# EAGLE design Aladdin Lamp (EAGLE 9.6.2)

## Sheet 1 of 2
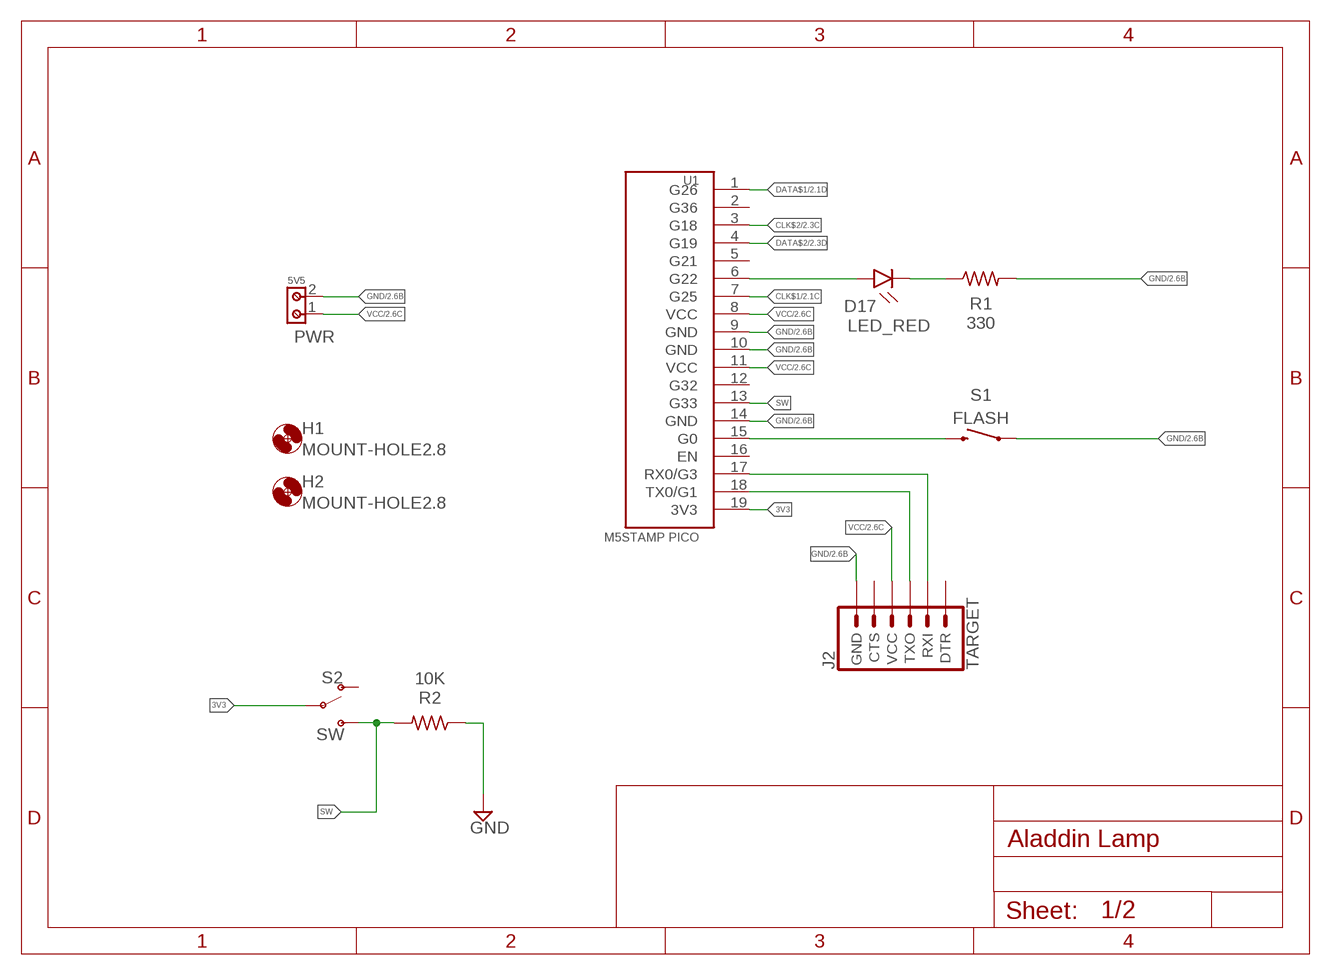
[diagram p0: schematic, sheet 1]

### Parts
D17  LED_RED  CHIP-FLAT-R_0805  [LEDC2012X110N_FLAT-R]
H1  MOUNT-HOLE2.8  [2,8]
H2  MOUNT-HOLE2.8  [2,8]
J2  TARGET  6_PIN_SERIAL_TARGETSILK  [6_PIN_SERIAL_TARGET_SIDE_W_SILK]
PWR  5V5  691213510002  [691213510002]
R1  330  R-US_CHIP-0805(2012-METRIC)  [RESC2012X65]
R2  10K  R-US_CHIP-0805(2012-METRIC)  [RESC2012X65]
S1  FLASH  MOMENTARY-SWITCH-SPST-SMD-5.2MM  [TACTILE_SWITCH_SMD_5.2MM]
S2  SW  SWITCH-SPDT-SMD-RIGHT-ANGLE  [SWITCH_SPST_SMD_A]
U1  M5STAMP PICO  M5STAMP-PICO  [M5STAMP-PICO]

### Nets
3V3: S2.2(P) U1.19(3V3)
CLK$1: U1.7(G25) ; also sheet 2
CLK$2: U1.3(G18) ; also sheet 2
DATA$1: U1.1(G26) ; also sheet 2
DATA$2: U1.4(G19) ; also sheet 2
G0: S1.3 U1.15(G0)
GND: J2.P$6(GND) PWR.2 R1.2 R2.1 S1.1 U1.9(GND) U1.10(GND) U1.14(GND) ; also sheet 2
RX: J2.P$3(RXI) U1.17(RX0/G3)
SATUS_LED$1: D17.A U1.6(G22)
SATUS_LED$2: D17.C R1.1
SW: R2.2 S2.3(S) U1.13(G33)
TX: J2.P$2(TXO) U1.18(TX0/G1)
VCC: J2.P$4(VCC) PWR.1 U1.8(VCC) U1.11(VCC) ; also sheet 2
Unconnected: J2.P$1(DTR) J2.P$5(CTS) S2.1(O) U1.2(G36) U1.5(G21) U1.12(G32) U1.16(EN)

## Sheet 2 of 2
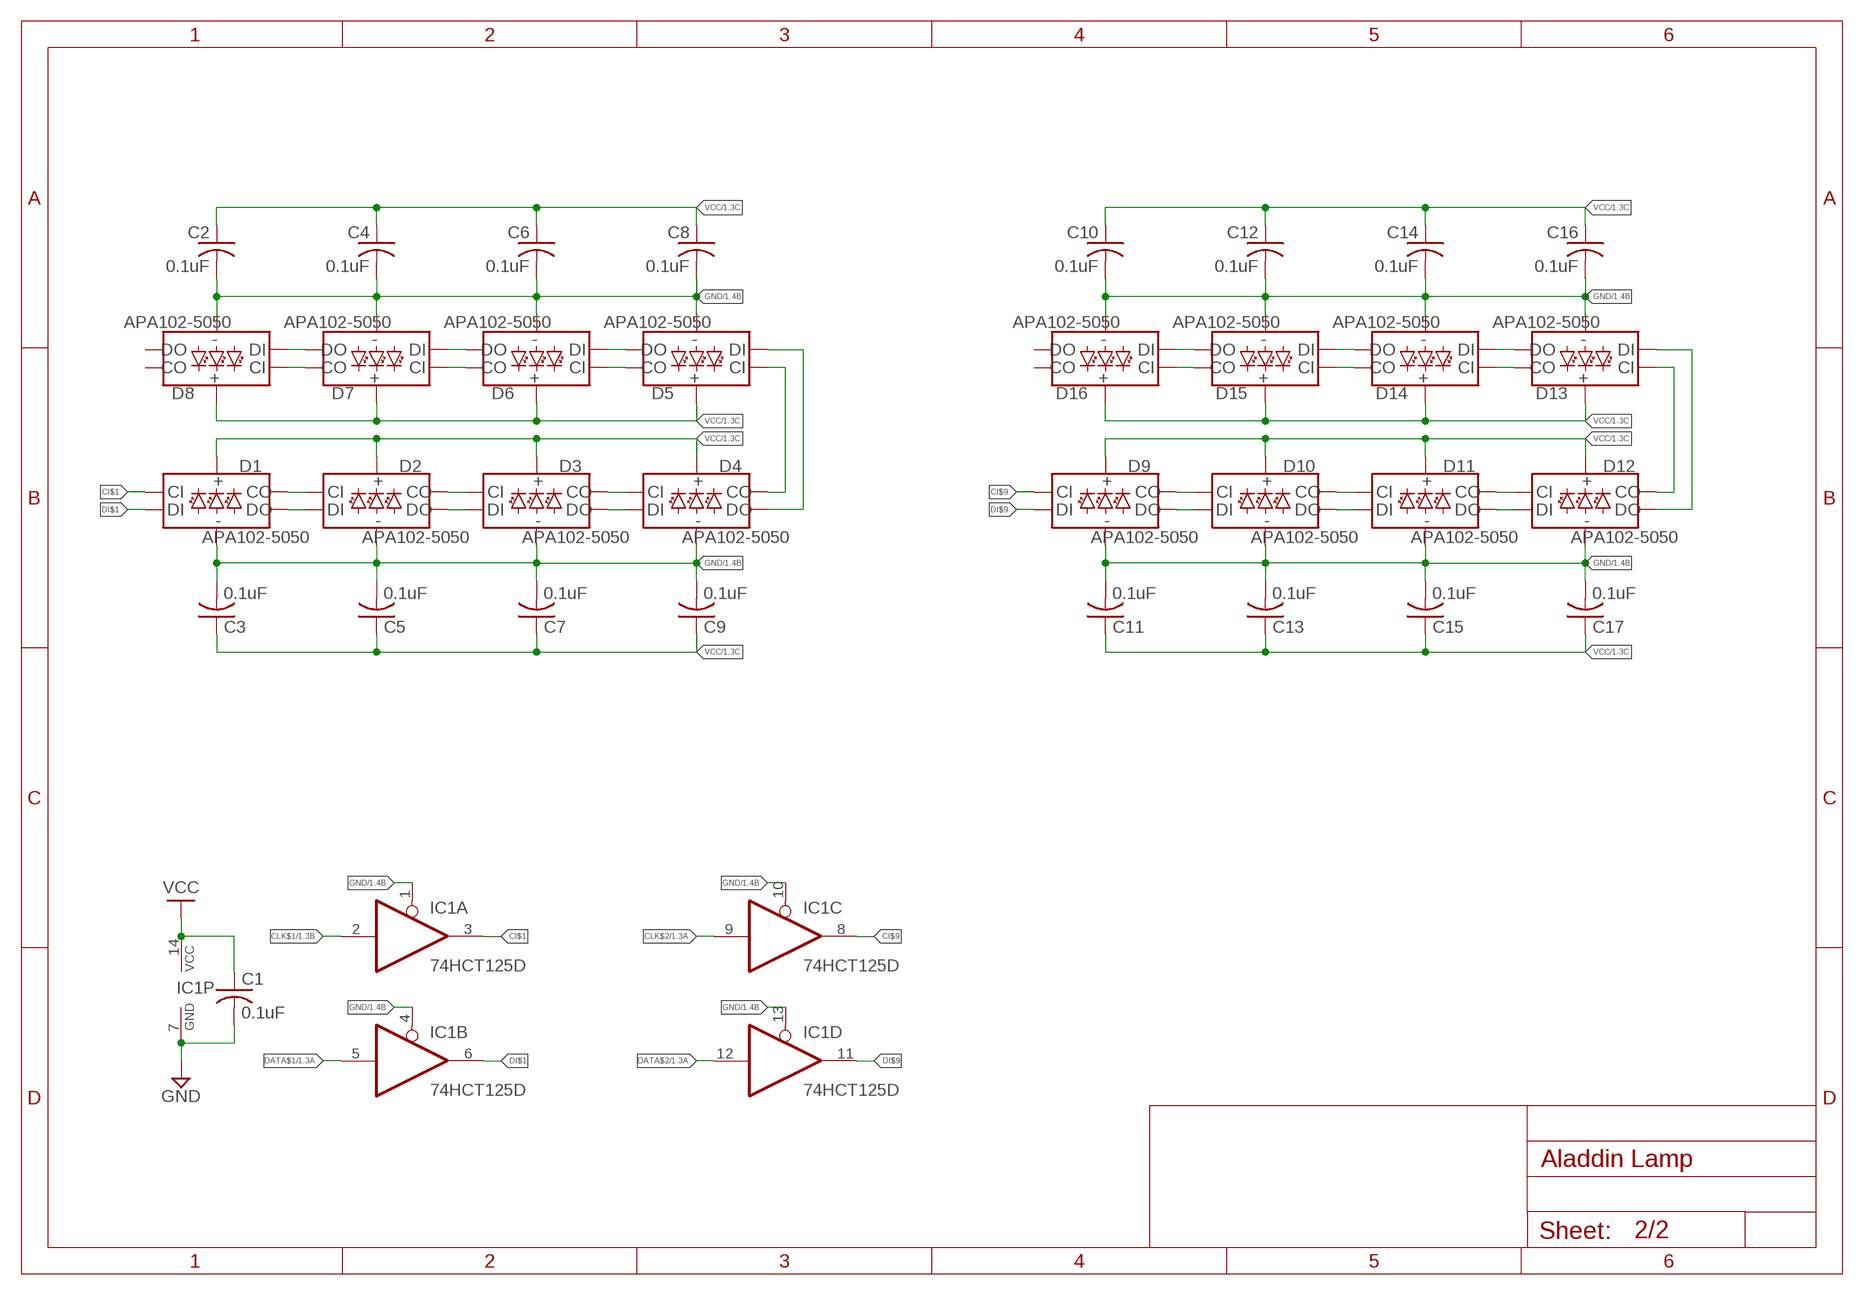
[diagram p1: schematic, sheet 2]

### Parts
C1  0.1uF  C-US_CHIP-0805(2012-METRIC)  [CAPC2012X110]
C2  0.1uF  C-US_CHIP-0805(2012-METRIC)  [CAPC2012X110]
C3  0.1uF  C-US_CHIP-0805(2012-METRIC)  [CAPC2012X110]
C4  0.1uF  C-US_CHIP-0805(2012-METRIC)  [CAPC2012X110]
C5  0.1uF  C-US_CHIP-0805(2012-METRIC)  [CAPC2012X110]
C6  0.1uF  C-US_CHIP-0805(2012-METRIC)  [CAPC2012X110]
C7  0.1uF  C-US_CHIP-0805(2012-METRIC)  [CAPC2012X110]
C8  0.1uF  C-US_CHIP-0805(2012-METRIC)  [CAPC2012X110]
C9  0.1uF  C-US_CHIP-0805(2012-METRIC)  [CAPC2012X110]
C10  0.1uF  C-US_CHIP-0805(2012-METRIC)  [CAPC2012X110]
C11  0.1uF  C-US_CHIP-0805(2012-METRIC)  [CAPC2012X110]
C12  0.1uF  C-US_CHIP-0805(2012-METRIC)  [CAPC2012X110]
C13  0.1uF  C-US_CHIP-0805(2012-METRIC)  [CAPC2012X110]
C14  0.1uF  C-US_CHIP-0805(2012-METRIC)  [CAPC2012X110]
C15  0.1uF  C-US_CHIP-0805(2012-METRIC)  [CAPC2012X110]
C16  0.1uF  C-US_CHIP-0805(2012-METRIC)  [CAPC2012X110]
C17  0.1uF  C-US_CHIP-0805(2012-METRIC)  [CAPC2012X110]
D1  APA102-5050  [APA102-5050]
D2  APA102-5050  [APA102-5050]
D3  APA102-5050  [APA102-5050]
D4  APA102-5050  [APA102-5050]
D5  APA102-5050  [APA102-5050]
D6  APA102-5050  [APA102-5050]
D7  APA102-5050  [APA102-5050]
D8  APA102-5050  [APA102-5050]
D9  APA102-5050  [APA102-5050]
D10  APA102-5050  [APA102-5050]
D11  APA102-5050  [APA102-5050]
D12  APA102-5050  [APA102-5050]
D13  APA102-5050  [APA102-5050]
D14  APA102-5050  [APA102-5050]
D15  APA102-5050  [APA102-5050]
D16  APA102-5050  [APA102-5050]
IC1  74HCT125D  [SO14]

### Nets
CI$1: D1.P2(CI) IC1.3(A:O)
CI$2: D1.P5(CO) D2.P2(CI)
CI$3: D2.P5(CO) D3.P2(CI)
CI$4: D3.P5(CO) D4.P2(CI)
CI$5: D4.P5(CO) D5.P2(CI)
CI$6: D5.P5(CO) D6.P2(CI)
CI$7: D6.P5(CO) D7.P2(CI)
CI$8: D7.P5(CO) D8.P2(CI)
CI$9: D9.P2(CI) IC1.8(C:O)
CI$10: D9.P5(CO) D10.P2(CI)
CI$11: D10.P5(CO) D11.P2(CI)
CI$12: D11.P5(CO) D12.P2(CI)
CI$13: D12.P5(CO) D13.P2(CI)
CI$14: D13.P5(CO) D14.P2(CI)
CI$15: D14.P5(CO) D15.P2(CI)
CI$16: D15.P5(CO) D16.P2(CI)
CLK$1: IC1.2(A:I) ; also sheet 1
CLK$2: IC1.9(C:I) ; also sheet 1
DATA$1: IC1.5(B:I) ; also sheet 1
DATA$2: IC1.12(D:I) ; also sheet 1
DI$1: D1.P1(DI) IC1.6(B:O)
DI$2: D1.P6(DO) D2.P1(DI)
DI$3: D2.P6(DO) D3.P1(DI)
DI$4: D3.P6(DO) D4.P1(DI)
DI$5: D4.P6(DO) D5.P1(DI)
DI$6: D5.P6(DO) D6.P1(DI)
DI$7: D6.P6(DO) D7.P1(DI)
DI$8: D7.P6(DO) D8.P1(DI)
DI$9: D9.P1(DI) IC1.11(D:O)
DI$10: D9.P6(DO) D10.P1(DI)
DI$11: D10.P6(DO) D11.P1(DI)
DI$12: D11.P6(DO) D12.P1(DI)
DI$13: D12.P6(DO) D13.P1(DI)
DI$14: D13.P6(DO) D14.P1(DI)
DI$15: D14.P6(DO) D15.P1(DI)
DI$16: D15.P6(DO) D16.P1(DI)
GND: C1.2 C2.2 C3.2 C4.2 C5.2 C6.2 C7.2 C8.2 C9.2 C10.2 C11.2 C12.2 C13.2 C14.2 C15.2 C16.2 C17.2 D1.P3(GND) D2.P3(GND) D3.P3(GND) D4.P3(GND) D5.P3(GND) D6.P3(GND) D7.P3(GND) D8.P3(GND) D9.P3(GND) D10.P3(GND) D11.P3(GND) D12.P3(GND) D13.P3(GND) D14.P3(GND) D15.P3(GND) D16.P3(GND) IC1.1(A:OE) IC1.4(B:OE) IC1.7(P:GND) IC1.10(C:OE) IC1.13(D:OE) ; also sheet 1
VCC: C1.1 C2.1 C3.1 C4.1 C5.1 C6.1 C7.1 C8.1 C9.1 C10.1 C11.1 C12.1 C13.1 C14.1 C15.1 C16.1 C17.1 D1.P4(VCC) D2.P4(VCC) D3.P4(VCC) D4.P4(VCC) D5.P4(VCC) D6.P4(VCC) D7.P4(VCC) D8.P4(VCC) D9.P4(VCC) D10.P4(VCC) D11.P4(VCC) D12.P4(VCC) D13.P4(VCC) D14.P4(VCC) D15.P4(VCC) D16.P4(VCC) IC1.14(P:VCC) ; also sheet 1
Unconnected: D8.P5(CO) D8.P6(DO) D16.P5(CO) D16.P6(DO)

## Library data of the parts
C1-C17 = Capacitor:C-US: Capacitor - ANSI; CATEGORY: Capacitor
D1-D16 = SparkFun-LED:APA102: Addressable RGB LED - 2 Wire Common names: APA102, Dotstar, etc. Packages: 5050 2020 SparkFun Products: SparkFun Lumenati Boards <https://www.sparkfun.com/categories/405>; PROD_ID: DIO-13739
D17 = LED:CHIP-FLAT-R; CATEGORY: LED; COLOR: RED; DESCRIPTION: CHIP LED FLAT; SUB-CATEGORY: CHIP; TYPE: FLAT_TOP
H1 H2 = holes:MOUNT-HOLE: MOUNTING HOLE with drill center marker
IC1 = 74xx-eu:74*125: Quad bus BUFFER, 3-state
J2 = custom:6_PIN_SERIAL_TARGET: 6-pin header connection for use with the "FTDI BASIC" pinout - TARGET SIDE. Also known as "Arduino Serial Program Header". It is used to mate with our FTDI Basic serial programmers using the Arduino IDE. Note, this device has "TARGET" in the name. It is intended to be used on a design that contains a target micro-controller that you wish to program. The "sister" device, named "CABLE" is inteneded to be used on a design that usually lives on the end of your USB cable and prvides the converter chip (FTDI232 or FTDI231x) to commnicate serial RX/TX. You can populate with some of these: Break Away Headers - Straight <https://www.sparkfun.com/products/116> (PRT-00116) For reference (or to suit your programming needs) check out these designs: SparkFun FTDI Basic Breakout - 5V <https://www.sparkfun.com/products/9716> (DEV-09716) SparkFun FTDI Basic Breakout - 3.3V <https://www.sparkfun.com/products/9873> (DEV-09873) SparkFun FTDI SmartBasic <https://www.sparkfun.com/products/12935> (DEV-12935) SparkFun Beefy 3 - FTDI Basic Breakout <https://www.sparkfun.com/products/13746> (DEV-13746)
PWR = Wurth_Connectors_WR-TBL Rising Cage Clamp:691213510002: WR-TBL Serie 2135 - 5.08 mm Horizontal Entry Modular w. Rising Cage Clamp KIND PROPERTIES Pitch 5.08 mm MATERIAL PROPERTIES Insulator Material PA66 Insulator Flammability Rating UL94 V-0 Contact Material Copper Alloy Contact Plating Tin over Nickel Contact Type Stamped Terminal Screw Material Steel Terminal Screw Plating Zinc Wire Guard Material Copper Alloy GENERAL INFORMATION Operating Temperature -30 up to +120 °C Compliance ROHS & Reach ELECTRICAL PROPERTIES IR UL 14 A IR VDE 14 A Working Voltage [UL] 300 V (AC) Working Voltage [VDE] 250 V (AC) Withstanding Voltage [UL] 1600 V (AC) Withstanding Voltage [VDE] 2000 V (AC) Contact Resistance 20 mΩ MECHANICAL PROPERTIES Wire Strip Length 6 Screw M3 CERTIFICATION UL Approval E150931 VDE Approval 40021366 PACKAGING PROPERTIES Packaging Box <https://www.we-online.com/catalog/media/o32805v209%20Family_WR-TBL2_Series2135.jpg> Details see: https://www.we-online.com/catalog/en/TBL_5_08_2135_HORIZONTAL_ENTRY_MODULAR_69121351000x/ Updated by Ella Wu 2019-11-26 2019(C) Wurth Elektronik; IR-UL: 14A; IR-VDE: 14A; PART-NUMBER: 691213510002; PINS: 2; PITCH: 5.08mm; TYPE: Horizontal; WIRE: 14 to 30 (AWG) 2.08 to 0.0509 (mm²); WORKING-VOLTAGE-UL: 300V (AC); WORKING-VOLTAGE-VDE: 250V (AC)
R1 R2 = Resistor:R-US: Resistor Fixed - ANSI; CATEGORY: Resistor; SUB-CATEGORY: Fixed
S1 = SparkFun-Switches:MOMENTARY-SWITCH-SPST: Momentary Switch (Pushbutton) - SPST Normally-open (NO) SPST momentary switches (buttons, pushbuttons). Variants PTH-12MM - 12mm square, through-hole Momentary Pushbutton Switch - 12mm Square <https://www.sparkfun.com/products/9190> (COM-09190) PTH-6.0MM, PTH-6.0MM-KIT - 6.0mm square, through-hole Mini Pushbutton Switch <https://www.sparkfun.com/products/97> (COM-00097) KIT package intended for soldering kit's - only one side of pads' copper is exposed. PTH-RIGHT-ANGLE-KIT - Right-angle, through-hole Right Angle Tactile Button <https://www.sparkfun.com/products/10791> - Used on SparkFun BigTime Watch Kit <https://www.sparkfun.com/products/11734> SMD-12MM - 12mm square, surface-mount Tactile Button - SMD (12mm) <https://www.sparkfun.com/products/12993> (COM-12993) Used on SparkFun PicoBoard <https://www.sparkfun.com/products/11888> SMD-4.5MM - 4.5mm Square Trackball Switch Used on SparkFun Blackberry Trackballer Breakout <https://www.sparkfun.com/products/13169> SMD-4.6MMX2.8MM - 4.60mm x 2.80mm, surface mount Used on SparkFun SAMD21 Mini Breakout <https://www.sparkfun.com/products/13664> SMD-5.2MM, SMD-5.2-REDUNDANT - 5.2mm square, surface-mount Mini Pushbutton Switch - SMD <https://www.sparkfun.com/products/8720> (COM-08720) Used on Arduino Pro Mini <https://www.sparkfun.com/products/11114> REDUNDANT package connects both switch circuits together SMD-6.0X3.5MM - 6.0 x 3.5mm, surface mount Momentary Reset Switch SMD <https://www.sparkfun.com/products/8229> (COM-08229) SMD-6.2MM-TALL - 6.2mm square, surface mount Tactile Button - SMD (6mm) <https://www.sparkfun.com/products/12992> Used on SparkFun Digital Sandbox <https://www.sparkfun.com/products/12651> SMD-RIGHT-ANGLE - Right-angle, surface mount Used on SparkFun Block for Intel® Edison - Arduino <https://www.sparkfun.com/products/13036>; PROD_ID: SWCH-08247; SF_SKU: COM-08720
S2 = SparkFun-Switches:SWITCH-SPDT: Single Pole, Double Throw (SPDT) Switch Single-pole, double-throw (SPDT) switch. Variant Overview SMD-AYZ0202 Surface Mount DPDT Switch <https://www.sparkfun.com/products/597> (COM-00597) Used on e.g. LilyPad Arduino USB - ATmega32U4 Board <https://www.sparkfun.com/products/12049> PTH-11.6X4.0MM SPDT Mini Power Switch <https://www.sparkfun.com/products/102> (COM-00102) Used on e.g. SparkFun Simon Says - Through-Hole Soldering Kit <https://www.sparkfun.com/products/10547> (KIT-10547) PTH-11.6X4.0MM-KIT KIT version of SPDT Mini Power Switch - Simplifies soldering by removing tStop of switch pins - only one side can be soldered. PTH-11.6X4.0MM-LOCK LOCK version of SPDT Mini Power Switch - Offset pins hold switch in place for easier soldering. SMD-RIGHT-ANGLE Surface Mount Right Angle Switch <https://www.sparkfun.com/products/10860> (COM-10860) Used on e.g. SparkFun ESP8266 Thing <https://www.sparkfun.com/products/13231>; PROD_ID: SWCH-10651; SF_SKU: COM-10860
U1 = custom:M5STAMP-PICO: M5 Stamp Pico <https://docs.m5stack.com/en/core/stamp_pico>

## Board
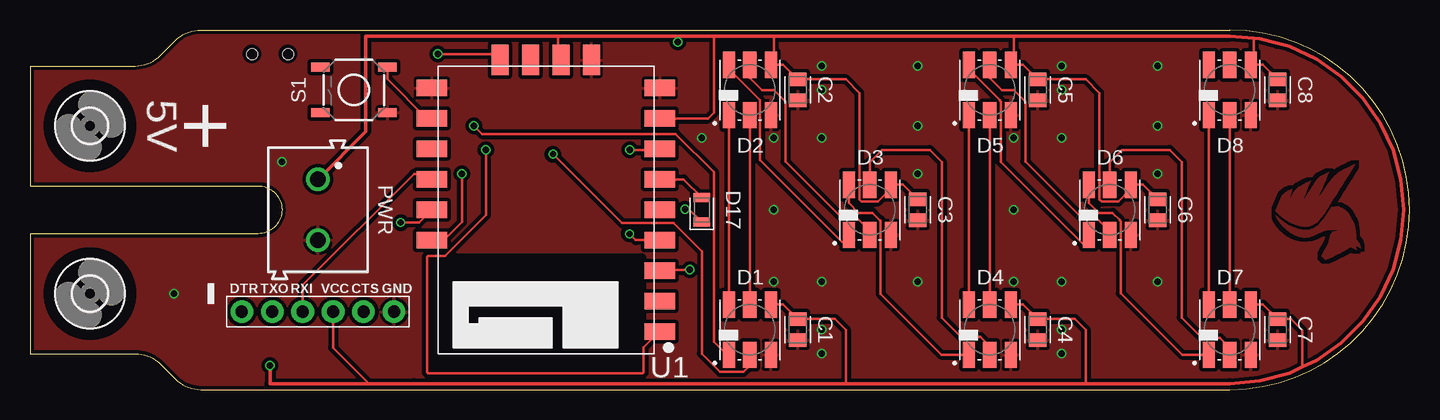
[diagram p2: board, top side]
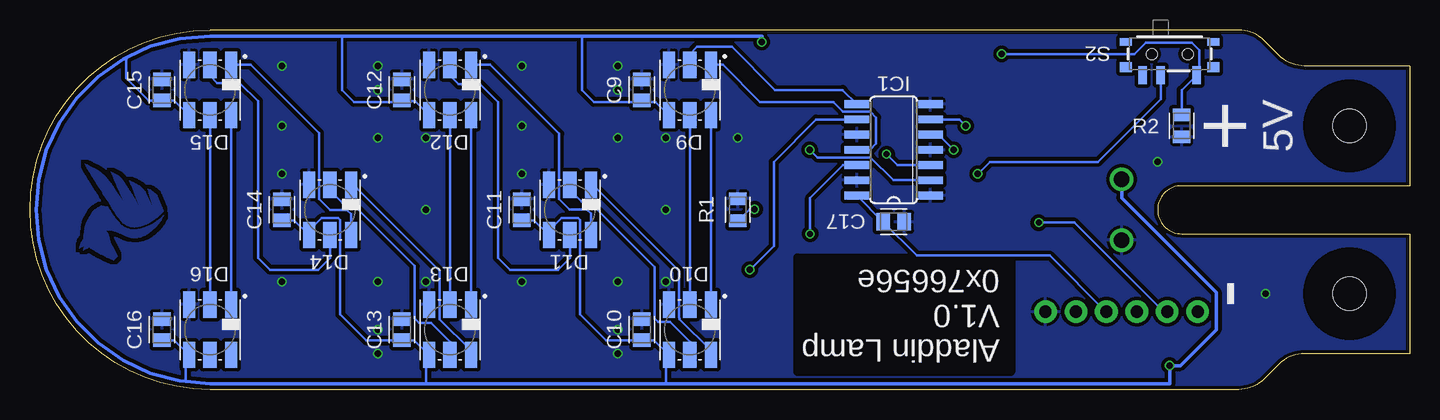
[diagram p3: board, bottom side, seen from below]

Size 115 x 30 mm. Coordinates in mm from the lower left corner, seen from the top.
Outline: 10.88,2.12 12.12,0.88 arc45 14.24,0 100,0 arc90 115,15 arc90 100,30 14.24,30 arc45 12.12,29.12 10.88,27.88 arc-45 8.76,27 0,27 0,17 19,17 arc-90 21,15 arc-90 19,13 0,13 0,3 8.76,3 arc-45 10.88,2.12
Copper layers (1*16): Top 0.035559375mm / dielectric 1.6mm / Bottom 0.035559375mm
Design rules "jlcpcb2layer": minimum track width 5mil, minimum drill 12mil, track to track 5mil, track to pad 5mil, pad to pad 5mil, via to via 5mil, smd to smd 5mil, copper to edge 8mil, drill to drill 6mil, minimum pad ring 5mil, minimum via ring 3mil, stop-mask expansion 2.5mil, vias tented up to drill 0mil, thermal gap 10mil

### Footprints (pad centres in the part's own frame; a part is rotated, then mirrored left to right if it is on the bottom)
CAPC2012X110 = smd 1.165 x 1.465: 1 -0.875,0; 2 0.875,0
APA102-5050 = smd 1 x 2.2: P1 -1.75,-2.1; P3 1.75,-2.1; P4 1.75,2.1; P6 -1.75,2.1 | smd 1.1 x 2.2: P2 0,-2.1; P5 0,2.1
LEDC2012X110N_FLAT-R = smd 0.762 x 1.362: A 1.025,0; C -1.025,0
2,8 = hole 2.8: 0,0
SO14 = smd 0.66 x 2.032: 1 -3.81,-3.073; 2 -2.54,-3.073; 3 -1.27,-3.073; 4 0,-3.073; 5 1.27,-3.073; 6 2.54,-3.073; 7 3.81,-3.073; 8 3.81,3.073; 9 2.54,3.073; 10 1.27,3.073; 11 0,3.073; 12 -1.27,3.073; 13 -2.54,3.073; 14 -3.81,3.073
6_PIN_SERIAL_TARGET_SIDE_W_SILK = drill 1.016 pad 1.88: P$1 -6.35,0; P$2 -3.81,0; P$3 -1.27,0; P$4 1.27,0; P$5 3.81,0; P$6 6.35,0
691213510002 = drill 1.3: 1 -2.54,0; 2 2.54,0
RESC2012X65 = smd 1.031 x 1.42: 1 -0.919,0; 2 0.919,0
TACTILE_SWITCH_SMD_5.2MM = smd 1.524 x 0.762: 1 -2.794,1.905; 2 2.794,1.905; 3 -2.794,-1.905; 4 2.794,-1.905
SWITCH_SPST_SMD_A = smd 0.7 x 1.5: 1 -2.25,-1.75; 2 -0.75,-1.75; 3 2.25,-1.75 | smd 1 x 0.6: GND1 -3.65,1; GND3 3.65,1 | smd 1 x 0.8: GND2 -3.65,-1.1; GND4 3.65,-1.1 | hole 0.9: -1.5,0; 1.5,0
M5STAMP-PICO = smd 2.54 x 1.4: 1 -9.5,10.16; 2 -9.5,7.62; 3 -9.5,5.08; 4 -9.5,2.54; 5 -9.5,0; 6 -9.5,-2.54; 7 -9.5,-5.08; 8 -9.5,-7.62; 9 -9.5,-10.16; 14 9.5,-10.16; 15 9.5,-7.62; 16 9.5,-5.08; 17 9.5,-2.54; 18 9.5,0; 19 9.5,2.54 | smd 1.4 x 2.54: 10 -3.81,-12.5; 11 -1.27,-12.5; 12 1.27,-12.5; 13 3.81,-12.5

### Placement (x,y rotation side)
C1  64,5 270 top
C2  64,25 270 top
C3  74,15 270 top
C4  84,5 270 top
C5  84,25 270 top
C6  94,15 270 top
C7  104,5 270 top
C8  104,25 270 top
C9  64,25 90 bottom
C10  64,5 90 bottom
C11  74,15 90 bottom
C12  84,25 90 bottom
C13  84,5 90 bottom
C14  94,15 90 bottom
C15  104,25 90 bottom
C16  104,5 90 bottom
C17  43,14 0 bottom
D1  60,5 0 top
D2  60,25 0 top
D3  70,15 0 top
D4  80,5 0 top
D5  80,25 0 top
D6  90,15 0 top
D7  100,5 0 top
D8  100,25 0 top
D9  60,25 180 bottom
D10  60,5 180 bottom
D11  70,15 180 bottom
D12  80,25 180 bottom
D13  80,5 180 bottom
D14  90,15 180 bottom
D15  100,25 180 bottom
D16  100,5 180 bottom
D17  56,15 90 top
H1  5,22 0 top
H2  5,8 0 top
IC1  43,20 90 bottom
J2  24,6.5 0 top
PWR  24,15 270 top
R1  56,15 90 bottom
R2  19,22 90 bottom
S1  27,25 180 top
S2  20,28 0 bottom
U1  43,15 180 top

### Tracks (layer width: path | path; a pad name or v marks a point on that pad's centre or on a via)
3V3  (via drill 0.51)
  Top 0.203: U1.19 34.5,12.46 36,13.96 v36,18
  Bottom 0.203: S2.2 20.75,24.25 26,19 35,19 v36,18
CI$1  (via drill 0.51)
  Top 0.203: v43.6,19.64 49.35,13.88 53.65,13.88 56,11.54 56,3 57.54,1.46 59.46,1.46 60,2 D1.P2
  Bottom 0.203: IC1.3 42.69,18.73 v43.6,19.64
CI$2
  Top 0.203: D2.P2 D1.P5
CI$3
  Top 0.203: D2.P5 60,26 61,25 62,25 62.96,24.04 62.96,19.04 67.66,14.34 68.89,14.34 70,13.23 D3.P2
CI$4
  Top 0.203: D3.P5 70,19 71,20 75,20 76,19 76,6 77.62,4.38 79.24,4.38 80,3.62 D4.P2
CI$5
  Top 0.203: D5.P2 D4.P5
CI$6
  Top 0.203: D5.P5 80,26 81,25 82,25 82.96,24.04 82.96,19.04 87.69,14.3 88.88,14.3 90,13.18 D6.P2
CI$7
  Top 0.203: D6.P5 90,19 91,20 95,20 96,19 96,6 97.69,4.31 99.19,4.31 100,3.5 D7.P2
CI$8
  Top 0.203: D7.P5 D8.P2
CI$9
  Bottom 0.203: IC1.8 47.26,25 52.9,25 56.5,28.6 59.4,28.6 60,28 D9.P2
CI$10
  Bottom 0.203: D9.P5 D10.P2
CI$11
  Bottom 0.203: D10.P5 60,4 61.64,5.64 62.64,5.64 62.94,5.94 62.94,10.23 68.41,15.7 69.03,15.7 69.85,16.52 70.09,16.52 70.09,17.01 D11.P2
CI$12
  Bottom 0.203: D11.P5 70,11 71,10 75,10 76,11 76,24 77.46,25.46 79.27,25.46 80,26.19 D12.P2
CI$13
  Bottom 0.203: D12.P5 D13.P2
CI$14
  Bottom 0.203: D13.P5 80,4 81.57,5.57 82.57,5.57 82.93,5.93 82.93,10.31 88.23,15.61 88.96,15.61 90,16.65 D14.P2
CI$15
  Bottom 0.203: D14.P5 90,11 91,10 95,10 96,11 96,24.07 97.5,25.57 99.4,25.57 100,26.17 D15.P2
CI$16
  Bottom 0.203: D15.P5 D16.P2
CLK$1  (via drill 0.51)
  Top 0.203: v50,20 52.42,20 U1.7
  Bottom 0.203: v50,20 49.37,19.36 44.93,19.36 43.03,17.46 IC1.2
CLK$2  (via drill 0.51)
  Top 0.203: U1.3 52.58,10 v55,10
  Bottom 0.203: v55,10 53,12 53,19 49.46,22.54 IC1.9
DATA$1  (via drill 0.51)
  Top 0.203: U1.1 51.16,3.5 51.16,1.43 51.07,1.33 33.18,1.33 33.09,1.43 33.09,11.07 33.18,11.16 34.61,11.16 38,14.56 v38,20
  Bottom 0.203: v38,20 39.27,21.27 IC1.5
DATA$2  (via drill 0.51)
  Top 0.203: v49.97,12.99 50.49,12.47 U1.4
  Bottom 0.203: v49.97,12.99 49.97,15.99 47.22,18.74 46.08,18.74 IC1.12
DI$1  (via drill 0.51)
  Top 0.203: v37,22 37.68,21.32 53.83,21.32 57,18.15 57,4 58.1,2.9 D1.P1
  Bottom 0.203: IC1.6 37.54,22.54 v37,22
DI$2
  Top 0.203: D2.P1 D1.P6
DI$3
  Top 0.203: D2.P6 58.25,26.73 60.85,24.13 60.85,19.14 68.1,11.9 68.25,11.9 D3.P1
DI$4
  Top 0.203: D4.P1 75.99,2.9 70.9,7.99 70.9,14.11 70.87,14.11 70.23,14.75 69.05,14.75 68.25,15.55 D3.P6
DI$5
  Top 0.203: D4.P6 D5.P1
DI$6
  Top 0.203: D5.P6 78.25,26.73 80.86,24.13 80.86,24.09 80.94,24 80.94,18.98 88.02,11.9 88.25,11.9 D6.P1
DI$7
  Top 0.203: D6.P6 88.25,15.57 89.09,14.73 90.25,14.73 90.86,14.13 90.86,14.1 90.92,14.03 90.92,8.03 96.05,2.9 D7.P1
DI$8
  Top 0.203: D8.P1 D7.P6
DI$9
  Bottom 0.203: IC1.11 45,20 44.46,20.54 44.46,22.7 44.93,23.18 47.22,23.18 48.04,24 54.15,24 57.25,27.1 D9.P1
DI$10
  Bottom 0.203: D10.P1 D9.P6
DI$11
  Bottom 0.203: D10.P6 58.25,3.27 60.85,5.87 60.85,5.96 60.91,6.01 60.91,9.91 68.25,17.25 D11.P1
DI$12
  Bottom 0.203: D11.P6 68.25,14.67 68.62,15.04 70.02,15.04 70.88,15.9 70.88,21.35 76.63,27.1 D12.P1
DI$13
  Bottom 0.203: D12.P6 D13.P1
DI$14
  Bottom 0.203: D14.P1 88.07,17.1 80.86,9.88 80.86,5.87 78.25,3.27 D13.P6
DI$15
  Bottom 0.203: D14.P6 88.25,14.63 88.62,15 90,15 90.9,15.9 90.9,21.4 96.6,27.1 D15.P1
DI$16
  Bottom 0.203: D15.P6 D16.P1
G0
  Top 0.203: U1.15 33.08,22.62 29.79,25.91 S1.3
GND  (via drill 0.51)
  other vias: 66,25 66,21 62,15 66,9 66,5 56,21 62,21 62,9 66,27 66,3 86,27 86,3 86,25 86,21 82,15 86,9 86,5 82,21 82,9 74,27 94,27 74,22 74,18 74,9 94,22 94,18 94,9 21,19 12,8
  pour Top (isolate 0.305, rank 2): 0,30 115,30 115,0 0,0
  pour Bottom (isolate 0.305, rank 2): 0,30 115,30 115,0 0,0
N$1
  pour Top: 106.33,13.58 105.97,13.61 105.63,13.7 105.29,13.83 104.98,13.99 104.67,14.19 104.39,14.4 104.12,14.64 103.87,14.89 104.06,15.39 104.26,15.89 104.41,16.18 104.63,16.41 104.91,16.59 105.2,16.74 105.2,16.74 105.05,16.21 104.89,15.68 104.74,15.15 104.97,15.63 105.21,16.12 105.37,16.42 105.58,16.69 105.83,16.92 106.11,17.11 106.41,17.28 106.72,17.41 106.5,16.85 106.28,16.28 106.06,15.71 105.84,15.15 106.16,15.68 106.48,16.21 106.81,16.74 107.13,17.27 107.34,17.57 107.62,17.8 107.93,17.98 108.26,18.14 108.11,17.8 107.97,17.46 107.82,17.12 107.68,16.78 107.53,16.44 107.39,16.1 107.24,15.76 107.1,15.42 107.32,15.75 107.53,16.09 107.75,16.42 107.97,16.75 108.15,17.03 108.34,17.3 108.54,17.56 108.77,17.8 109.01,18.03 109.28,18.22 109.56,18.39 109.86,18.54 110.16,18.67 110.46,18.81 110.26,18.5 110.07,18.2 109.88,17.89 109.69,17.59 109.3,16.98 109.11,16.67 108.92,16.37 108.73,16.06 108.53,15.76 108.37,15.48 108.2,15.2 108.03,14.92 107.85,14.65 107.66,14.39 107.45,14.14 107.22,13.92 106.95,13.73 106.65,13.61
N$2
  pour Top: 108.03,10.81 107.68,11.15 107.98,11.68 108.28,12.2 108.36,12.55 108.44,12.89 108.67,13.17 109,13.28 108.65,13.33 108.3,13.29 107.96,13.21 107.62,13.1 107.29,12.97 106.98,12.81 106.61,12.67 106.22,12.64 105.83,12.71 105.46,12.85 105.12,13.05 104.81,13.3 104.52,13.57 104.27,13.87 104.04,14.19 103.84,14.53 104.12,14.27 104.42,14.03 104.82,13.77 105.25,13.55 105.78,13.38 106.32,13.3 106.71,13.34 107.07,13.49 107.38,13.7 107.66,13.96 107.9,14.26 108.12,14.57 108.33,14.9 108.53,15.23 108.54,15.25 109.04,15.33 109.34,15.17 109.6,14.96 109.84,14.72 110.04,14.45 110.2,14.16 110.33,13.85 110.43,13.52 110.5,13.2 110.52,12.86 110.51,12.52 110.78,12.21 110.88,11.82 110.45,12.02 110.58,11.63 110.06,11.91 109.75,11.67 109.46,11.52 109.18,11.37 108.89,11.22 108.61,11.08 108.32,10.94
N$3
  pour Bottom: 106.33,13.58 105.97,13.61 105.63,13.7 105.29,13.83 104.98,13.99 104.67,14.19 104.39,14.4 104.12,14.64 103.87,14.89 104.06,15.39 104.26,15.89 104.41,16.18 104.63,16.41 104.91,16.59 105.2,16.74 105.2,16.74 105.05,16.21 104.89,15.68 104.74,15.15 104.97,15.63 105.21,16.12 105.37,16.42 105.58,16.69 105.83,16.92 106.11,17.11 106.41,17.28 106.72,17.41 106.5,16.85 106.28,16.28 106.06,15.71 105.84,15.15 106.16,15.68 106.48,16.21 106.81,16.74 107.13,17.27 107.34,17.57 107.62,17.8 107.93,17.98 108.26,18.14 108.11,17.8 107.97,17.46 107.82,17.12 107.68,16.78 107.53,16.44 107.39,16.1 107.24,15.76 107.1,15.42 107.32,15.75 107.53,16.09 107.75,16.42 107.97,16.75 108.15,17.03 108.34,17.3 108.54,17.56 108.77,17.8 109.01,18.03 109.28,18.22 109.56,18.39 109.86,18.54 110.16,18.67 110.46,18.81 110.26,18.5 110.07,18.2 109.88,17.89 109.69,17.59 109.3,16.98 109.11,16.67 108.92,16.37 108.73,16.06 108.53,15.76 108.37,15.48 108.2,15.2 108.03,14.92 107.85,14.65 107.66,14.39 107.45,14.14 107.22,13.92 106.95,13.73 106.65,13.61
N$4
  pour Bottom: 108.03,10.81 107.68,11.15 107.98,11.68 108.28,12.2 108.36,12.55 108.44,12.89 108.67,13.17 109,13.28 108.65,13.33 108.3,13.29 107.96,13.21 107.62,13.1 107.29,12.97 106.98,12.81 106.61,12.67 106.22,12.64 105.83,12.71 105.46,12.85 105.12,13.05 104.81,13.3 104.52,13.57 104.27,13.87 104.04,14.19 103.84,14.53 104.12,14.27 104.42,14.03 104.82,13.77 105.25,13.55 105.78,13.38 106.32,13.3 106.71,13.34 107.07,13.49 107.38,13.7 107.66,13.96 107.9,14.26 108.12,14.57 108.33,14.9 108.53,15.23 108.54,15.25 109.04,15.33 109.34,15.17 109.6,14.96 109.84,14.72 110.04,14.45 110.2,14.16 110.33,13.85 110.43,13.52 110.5,13.2 110.52,12.86 110.51,12.52 110.78,12.21 110.88,11.82 110.45,12.02 110.58,11.63 110.06,11.91 109.75,11.67 109.46,11.52 109.18,11.37 108.89,11.22 108.61,11.08 108.32,10.94
RX
  Top 0.203: U1.17 33.04,18 32,18 22.73,8.73 J2.P$3
SATUS_LED$1
  Top 0.203: U1.6 54.48,17.54 D17.A
SATUS_LED$2  (via drill 0.51)
  Top 0.203: D17.C 54.94,15.04 v54.6,15.04
  Bottom 0.203: v54.6,15.04 55.04,15.04 R1.1
SW  (via drill 0.51)
  Top 0.203: U1.13 38.69,28 v34,28
  Bottom 0.203: v34,28 22.94,28 21.99,28.95 18.16,28.95 17.53,28.32 17.53,26.47 S2.3 19,25 R2.2
TX  (via drill 0.51)
  Top 0.203: U1.18 32.43,13.93 v30.91,13.93
  Bottom 0.203: J2.P$2 20.5,6.5 27.93,13.93 v30.91,13.93
VCC  (via drill 0.51)
  Top 0.203: D1.P4 62.77,7.1 C1.1 67.12,5.88 68,5 68,0.5 | D4.P4 82.78,7.1 C4.1 87.12,5.88 88,5 88,0.5 | C8.1 102.78,27.1 D8.P4 102.03,27.38 102.03,29.32 | D7.P4 102.78,7.1 C7.1 105.12,5.88 106.06,4.95 106.06,1.88 | C6.1 92.78,17.1 D6.P4 91.75,16.72 90.71,15.68 89.34,15.68 89.14,15.87 89.14,24.73 88,25.88 C5.1 82.78,27.1 D5.P4 82,27.35 82,29.5 | 62,29.5 62,27.35 D2.P4 62.77,27.1 C2.1 68,25.88 69.14,24.73 69.14,15.87 69.32,15.7 70.68,15.7 71.75,16.77 D3.P4 72.75,17.1 73.97,15.88 C3.1 | 57,29.5 57,23.12 56.5,22.62 U1.8 | U1.11 44,27.77 44,29.5 | J2.P$4 25.27,3.5 28.27,0.5 32,0.5
  Top 0.305: 54,29.5 44,29.5 27.99,29.5 27.99,21.53 PWR.1 | 54,29.5 57,29.5 62,29.5 82,29.5 100,29.5 102.03,29.32 102.52,29.28 103.97,28.89 104.96,28.63 107.25,27.56 109.32,26.11 111.11,24.32 112.56,22.25 113.63,19.96 114.28,17.52 114.5,15 114.28,12.48 113.63,10.04 112.56,7.75 111.11,5.68 109.32,3.89 107.25,2.44 106.06,1.88 104.96,1.37 102.52,0.72 100,0.5 88,0.5 68,0.5 32,0.5 20,0.5 v20,2 | v54,29 54,29.5
  Bottom 0.203: 62,2.65 62,0.5 | 82,2.65 82,0.5 | 102.03,2.62 102.03,0.68 | 69,29.5 69,25 68,24 64.12,24 62.85,24 D9.P4 | 84.12,24 88,24 89,25 89,29.5 | 107,27.61 107,26 105.12,24.12 C15.1 102.97,24.12 D15.P4 | IC1.14 C17.1 41.05,11.17 30,11.17 25.33,6.5 J2.P$4 | C11.1 72.97,14.12 D11.P4 71.75,13.25 70.69,14.3 69.32,14.3 69.14,14.13 69.14,6.27 67,4.12 C10.1 62.98,4.12 D10.P4 | C14.1 92.97,14.12 D14.P4 91.75,13.23 90.68,14.3 89.32,14.3 89.14,14.13 89.14,6.27 87,4.12 C13.1 82.97,4.12 D13.P4 | D12.P4 82.91,24.06 84.06,24.06 | D16.P4 102.97,4.12 C16.1
  Bottom 0.305: 106.88,27.73 107.25,27.56 109.32,26.11 111.11,24.32 112.56,22.25 113.63,19.96 114.28,17.52 114.5,15 114.28,12.48 113.63,10.04 112.56,7.75 111.11,5.68 109.32,3.89 107.25,2.44 104.96,1.37 102.52,0.72 102.03,0.68 100,0.5 82,0.5 62,0.5 20,0.5 v20,2 19.11,2 16.11,5 16.11,8.11 24,16 PWR.1 | 106.88,27.73 104.96,28.63 102.52,29.28 100,29.5 89,29.5 69,29.5 54,29.5 v54,29 | D10.P4 62,2.65 | D13.P4 82,2.65 | D16.P4 102.03,2.62 | C9.1 64.12,24 | C12.1 84.06,24.06 84.12,24 | 107,27.61 106.88,27.73

### Text on the board
tPlace: 5V | + | -
bPlace: 5V | + | Aladdin Lamp / V1.0 / 0x76656e | -